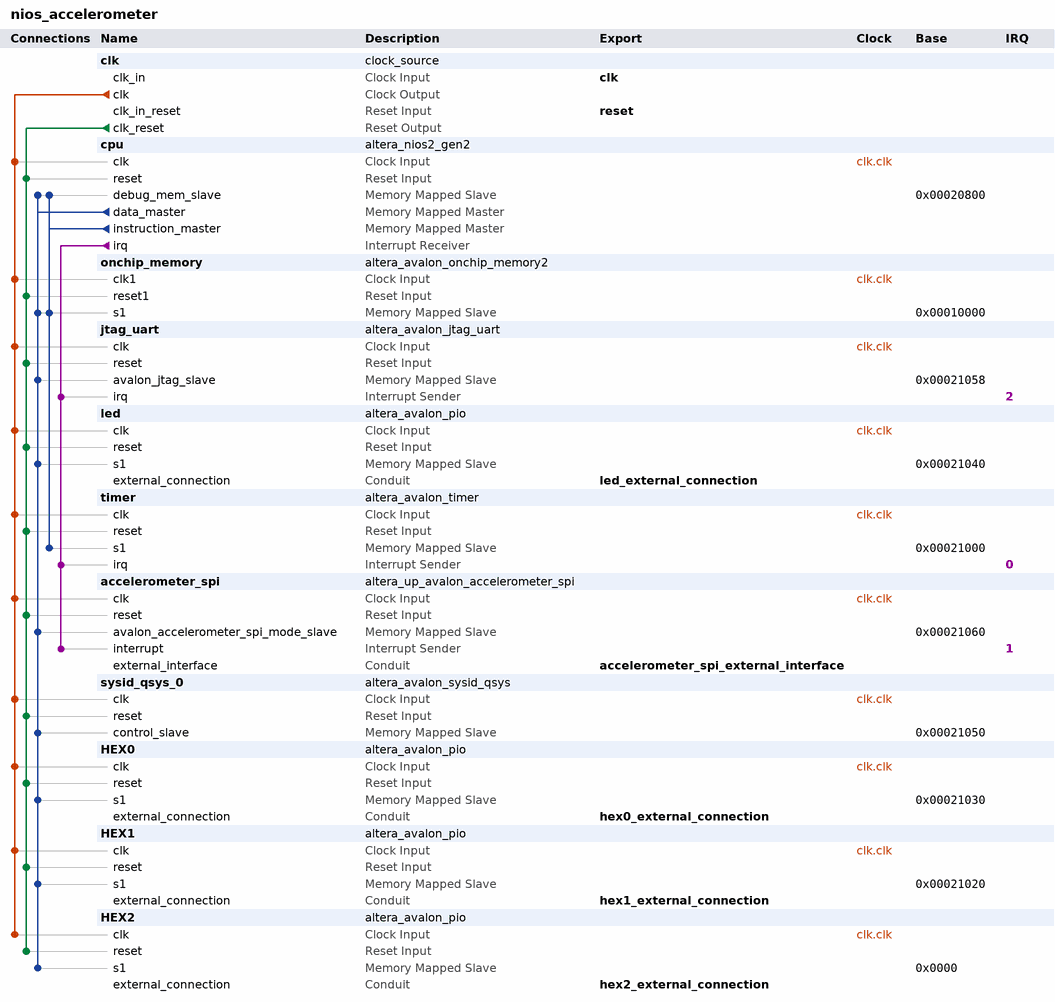
[diagram p0: system contents]
# Platform Designer (Qsys) system nios_accelerometer, MAX 10 10M50DAF484C7G
# Parameters at their usual value, and those the tool derives, are not listed.
package require -exact qsys 22.1
create_system nios_accelerometer
set_project_property DEVICE_FAMILY {MAX 10}
set_project_property DEVICE 10M50DAF484C7G

add_instance clk clock_source 22.1
set_instance_parameter_value clk clockFrequency 50000000

add_instance cpu altera_nios2_gen2 22.1
set_instance_parameter_value cpu dcache_size 2048
set_instance_parameter_value cpu exceptionSlave onchip_memory.s1
set_instance_parameter_value cpu icache_size 4096
set_instance_parameter_value cpu impl Tiny
set_instance_parameter_value cpu resetSlave onchip_memory.s1

add_instance onchip_memory altera_avalon_onchip_memory2 22.1
set_instance_parameter_value onchip_memory dataWidth 32
set_instance_parameter_value onchip_memory dualPort false
set_instance_parameter_value onchip_memory initMemContent false
set_instance_parameter_value onchip_memory initializationFileName onchip_mem.hex
set_instance_parameter_value onchip_memory memorySize 65536

add_instance jtag_uart altera_avalon_jtag_uart 22.1
set_instance_parameter_value jtag_uart simInteractiveOptions NO_INTERACTIVE_WINDOWS

add_instance led altera_avalon_pio 22.1
set_instance_parameter_value led direction Output
set_instance_parameter_value led width 10

add_instance timer altera_avalon_timer 22.1
set_instance_parameter_value timer period 1
set_instance_parameter_value timer periodUnits MSEC

add_instance accelerometer_spi altera_up_avalon_accelerometer_spi 18.0

add_instance sysid_qsys_0 altera_avalon_sysid_qsys 22.1
set_instance_parameter_value sysid_qsys_0 id 0

add_instance HEX0 altera_avalon_pio 22.1
set_instance_parameter_value HEX0 direction Output
set_instance_parameter_value HEX0 width 7

add_instance HEX1 altera_avalon_pio 22.1
set_instance_parameter_value HEX1 direction Output
set_instance_parameter_value HEX1 width 7

add_instance HEX2 altera_avalon_pio 22.1
set_instance_parameter_value HEX2 direction Output
set_instance_parameter_value HEX2 width 7

# connections
add_connection clk.clk accelerometer_spi.clk clock
add_connection clk.clk cpu.clk clock
add_connection clk.clk HEX0.clk clock
add_connection clk.clk HEX1.clk clock
add_connection clk.clk HEX2.clk clock
add_connection clk.clk jtag_uart.clk clock
add_connection clk.clk led.clk clock
add_connection clk.clk onchip_memory.clk1 clock
add_connection clk.clk sysid_qsys_0.clk clock
add_connection clk.clk timer.clk clock
add_connection clk.clk_reset accelerometer_spi.reset reset
add_connection clk.clk_reset cpu.reset reset
add_connection clk.clk_reset HEX0.reset reset
add_connection clk.clk_reset HEX1.reset reset
add_connection clk.clk_reset HEX2.reset reset
add_connection clk.clk_reset jtag_uart.reset reset
add_connection clk.clk_reset led.reset reset
add_connection clk.clk_reset onchip_memory.reset1 reset
add_connection clk.clk_reset sysid_qsys_0.reset reset
add_connection clk.clk_reset timer.reset reset
add_connection cpu.data_master accelerometer_spi.avalon_accelerometer_spi_mode_slave avalon
set_connection_parameter_value cpu.data_master/accelerometer_spi.avalon_accelerometer_spi_mode_slave baseAddress 0x00021060
add_connection cpu.data_master cpu.debug_mem_slave avalon
set_connection_parameter_value cpu.data_master/cpu.debug_mem_slave baseAddress 0x00020800
add_connection cpu.data_master HEX0.s1 avalon
set_connection_parameter_value cpu.data_master/HEX0.s1 baseAddress 0x00021030
add_connection cpu.data_master HEX1.s1 avalon
set_connection_parameter_value cpu.data_master/HEX1.s1 baseAddress 0x00021020
add_connection cpu.data_master HEX2.s1 avalon
set_connection_parameter_value cpu.data_master/HEX2.s1 baseAddress 0x0000
add_connection cpu.data_master jtag_uart.avalon_jtag_slave avalon
set_connection_parameter_value cpu.data_master/jtag_uart.avalon_jtag_slave baseAddress 0x00021058
add_connection cpu.data_master led.s1 avalon
set_connection_parameter_value cpu.data_master/led.s1 baseAddress 0x00021040
add_connection cpu.data_master onchip_memory.s1 avalon
set_connection_parameter_value cpu.data_master/onchip_memory.s1 baseAddress 0x00010000
add_connection cpu.data_master sysid_qsys_0.control_slave avalon
set_connection_parameter_value cpu.data_master/sysid_qsys_0.control_slave baseAddress 0x00021050
add_connection cpu.instruction_master cpu.debug_mem_slave avalon
set_connection_parameter_value cpu.instruction_master/cpu.debug_mem_slave baseAddress 0x00020800
add_connection cpu.instruction_master onchip_memory.s1 avalon
set_connection_parameter_value cpu.instruction_master/onchip_memory.s1 baseAddress 0x00010000
add_connection cpu.instruction_master timer.s1 avalon
set_connection_parameter_value cpu.instruction_master/timer.s1 baseAddress 0x00021000
add_connection cpu.irq accelerometer_spi.interrupt interrupt
set_connection_parameter_value cpu.irq/accelerometer_spi.interrupt irqNumber 1
add_connection cpu.irq jtag_uart.irq interrupt
set_connection_parameter_value cpu.irq/jtag_uart.irq irqNumber 2
add_connection cpu.irq timer.irq interrupt
set_connection_parameter_value cpu.irq/timer.irq irqNumber 0

# exported interfaces
add_interface accelerometer_spi_external_interface conduit end
set_interface_property accelerometer_spi_external_interface EXPORT_OF accelerometer_spi.external_interface
add_interface clk clock sink
set_interface_property clk EXPORT_OF clk.clk_in
add_interface hex0_external_connection conduit end
set_interface_property hex0_external_connection EXPORT_OF HEX0.external_connection
add_interface hex1_external_connection conduit end
set_interface_property hex1_external_connection EXPORT_OF HEX1.external_connection
add_interface hex2_external_connection conduit end
set_interface_property hex2_external_connection EXPORT_OF HEX2.external_connection
add_interface led_external_connection conduit end
set_interface_property led_external_connection EXPORT_OF led.external_connection
add_interface reset reset sink
set_interface_property reset EXPORT_OF clk.clk_in_reset

set_interconnect_requirement {$system} qsys_mm.clockCrossingAdapter HANDSHAKE
set_interconnect_requirement {$system} qsys_mm.enableEccProtection FALSE
set_interconnect_requirement {$system} qsys_mm.insertDefaultSlave FALSE
set_interconnect_requirement {$system} qsys_mm.maxAdditionalLatency 1

save_system nios_accelerometer.qsys
